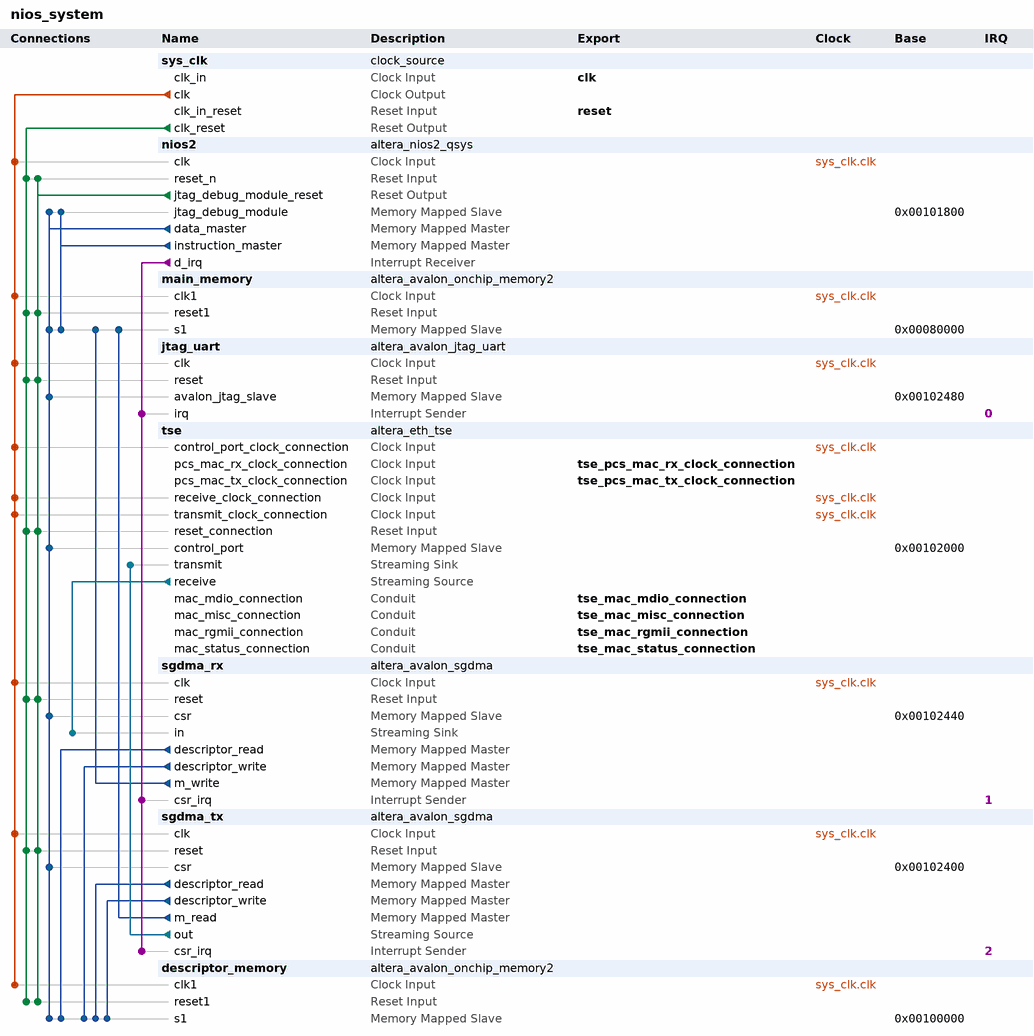
[diagram p0: system contents]
# Platform Designer (Qsys) system nios_system, Cyclone V 5CSEBA6U23I7
# Parameters at their usual value, and those the tool derives, are not listed.
package require -exact qsys 16.1
create_system nios_system
set_project_property DEVICE_FAMILY {Cyclone V}
set_project_property DEVICE 5CSEBA6U23I7

add_instance sys_clk clock_source 16.1
set_instance_parameter_value sys_clk clockFrequency 100000000

add_instance nios2 altera_nios2_qsys 16.1
set_instance_parameter_value nios2 breakSlave nios2.jtag_debug_module
set_instance_parameter_value nios2 exceptionSlave main_memory.s1
set_instance_parameter_value nios2 icache_size 4096
set_instance_parameter_value nios2 impl Small
set_instance_parameter_value nios2 mmu_TLBMissExcSlave None
set_instance_parameter_value nios2 resetSlave main_memory.s1
set_instance_parameter_value nios2 resetrequest_enabled true

add_instance main_memory altera_avalon_onchip_memory2 16.1
set_instance_parameter_value main_memory dataWidth 32
set_instance_parameter_value main_memory dualPort false
set_instance_parameter_value main_memory initMemContent true
set_instance_parameter_value main_memory initializationFileName onchip_mem.hex
set_instance_parameter_value main_memory memorySize 307200

add_instance jtag_uart altera_avalon_jtag_uart 16.1
set_instance_parameter_value jtag_uart simInteractiveOptions NO_INTERACTIVE_WINDOWS

add_instance tse altera_eth_tse 16.1
set_instance_parameter_value tse core_variation MAC_ONLY
set_instance_parameter_value tse enable_hd_logic true
set_instance_parameter_value tse enable_mac_flow_ctrl false
set_instance_parameter_value tse enable_magic_detect true
set_instance_parameter_value tse enable_shift16 true
set_instance_parameter_value tse ifGMII RGMII
set_instance_parameter_value tse ing_addr 11
set_instance_parameter_value tse mdio_clk_div 40
set_instance_parameter_value tse stat_cnt_ena true
set_instance_parameter_value tse transceiver_type NONE

add_instance sgdma_rx altera_avalon_sgdma 16.1
set_instance_parameter_value sgdma_rx enableBurstTransfers false
set_instance_parameter_value sgdma_rx enableUnalignedTransfers false
set_instance_parameter_value sgdma_rx readBlockDataWidth 32
set_instance_parameter_value sgdma_rx sinkErrorWidth 6
set_instance_parameter_value sgdma_rx sourceErrorWidth 0
set_instance_parameter_value sgdma_rx transferMode STREAM_TO_MEMORY
set_instance_parameter_value sgdma_rx writeBurstcountWidth 4

add_instance sgdma_tx altera_avalon_sgdma 16.1
set_instance_parameter_value sgdma_tx enableBurstTransfers false
set_instance_parameter_value sgdma_tx enableUnalignedTransfers false
set_instance_parameter_value sgdma_tx readBlockDataWidth 32
set_instance_parameter_value sgdma_tx sinkErrorWidth 0
set_instance_parameter_value sgdma_tx sourceErrorWidth 1
set_instance_parameter_value sgdma_tx transferMode MEMORY_TO_STREAM
set_instance_parameter_value sgdma_tx writeBurstcountWidth 4

add_instance descriptor_memory altera_avalon_onchip_memory2 16.1
set_instance_parameter_value descriptor_memory dataWidth 32
set_instance_parameter_value descriptor_memory dualPort false
set_instance_parameter_value descriptor_memory initMemContent true
set_instance_parameter_value descriptor_memory initializationFileName onchip_mem.hex
set_instance_parameter_value descriptor_memory memorySize 4096

# connections
add_connection sys_clk.clk descriptor_memory.clk1 clock
add_connection sys_clk.clk jtag_uart.clk clock
add_connection sys_clk.clk main_memory.clk1 clock
add_connection sys_clk.clk nios2.clk clock
add_connection sys_clk.clk sgdma_rx.clk clock
add_connection sys_clk.clk sgdma_tx.clk clock
add_connection sys_clk.clk tse.control_port_clock_connection clock
add_connection sys_clk.clk tse.receive_clock_connection clock
add_connection sys_clk.clk tse.transmit_clock_connection clock
add_connection nios2.jtag_debug_module_reset descriptor_memory.reset1 reset
add_connection nios2.jtag_debug_module_reset jtag_uart.reset reset
add_connection nios2.jtag_debug_module_reset main_memory.reset1 reset
add_connection nios2.jtag_debug_module_reset nios2.reset_n reset
add_connection nios2.jtag_debug_module_reset sgdma_rx.reset reset
add_connection nios2.jtag_debug_module_reset sgdma_tx.reset reset
add_connection nios2.jtag_debug_module_reset tse.reset_connection reset
add_connection sys_clk.clk_reset descriptor_memory.reset1 reset
add_connection sys_clk.clk_reset jtag_uart.reset reset
add_connection sys_clk.clk_reset main_memory.reset1 reset
add_connection sys_clk.clk_reset nios2.reset_n reset
add_connection sys_clk.clk_reset sgdma_rx.reset reset
add_connection sys_clk.clk_reset sgdma_tx.reset reset
add_connection sys_clk.clk_reset tse.reset_connection reset
add_connection nios2.data_master descriptor_memory.s1 avalon
set_connection_parameter_value nios2.data_master/descriptor_memory.s1 baseAddress 0x00100000
add_connection nios2.data_master jtag_uart.avalon_jtag_slave avalon
set_connection_parameter_value nios2.data_master/jtag_uart.avalon_jtag_slave baseAddress 0x00102480
add_connection nios2.data_master main_memory.s1 avalon
set_connection_parameter_value nios2.data_master/main_memory.s1 baseAddress 0x00080000
add_connection nios2.data_master nios2.jtag_debug_module avalon
set_connection_parameter_value nios2.data_master/nios2.jtag_debug_module baseAddress 0x00101800
add_connection nios2.data_master sgdma_rx.csr avalon
set_connection_parameter_value nios2.data_master/sgdma_rx.csr baseAddress 0x00102440
add_connection nios2.data_master sgdma_tx.csr avalon
set_connection_parameter_value nios2.data_master/sgdma_tx.csr baseAddress 0x00102400
add_connection nios2.data_master tse.control_port avalon
set_connection_parameter_value nios2.data_master/tse.control_port baseAddress 0x00102000
add_connection nios2.instruction_master main_memory.s1 avalon
set_connection_parameter_value nios2.instruction_master/main_memory.s1 baseAddress 0x00080000
add_connection nios2.instruction_master nios2.jtag_debug_module avalon
set_connection_parameter_value nios2.instruction_master/nios2.jtag_debug_module baseAddress 0x00101800
add_connection sgdma_rx.descriptor_read descriptor_memory.s1 avalon
set_connection_parameter_value sgdma_rx.descriptor_read/descriptor_memory.s1 baseAddress 0x00100000
add_connection sgdma_rx.descriptor_write descriptor_memory.s1 avalon
set_connection_parameter_value sgdma_rx.descriptor_write/descriptor_memory.s1 baseAddress 0x00100000
add_connection sgdma_rx.m_write main_memory.s1 avalon
set_connection_parameter_value sgdma_rx.m_write/main_memory.s1 baseAddress 0x00080000
add_connection sgdma_tx.descriptor_read descriptor_memory.s1 avalon
set_connection_parameter_value sgdma_tx.descriptor_read/descriptor_memory.s1 baseAddress 0x00100000
add_connection sgdma_tx.descriptor_write descriptor_memory.s1 avalon
set_connection_parameter_value sgdma_tx.descriptor_write/descriptor_memory.s1 baseAddress 0x00100000
add_connection sgdma_tx.m_read main_memory.s1 avalon
set_connection_parameter_value sgdma_tx.m_read/main_memory.s1 baseAddress 0x00080000
add_connection sgdma_tx.out tse.transmit avalon_streaming
add_connection tse.receive sgdma_rx.in avalon_streaming
add_connection nios2.d_irq jtag_uart.irq interrupt
set_connection_parameter_value nios2.d_irq/jtag_uart.irq irqNumber 0
add_connection nios2.d_irq sgdma_rx.csr_irq interrupt
set_connection_parameter_value nios2.d_irq/sgdma_rx.csr_irq irqNumber 1
add_connection nios2.d_irq sgdma_tx.csr_irq interrupt
set_connection_parameter_value nios2.d_irq/sgdma_tx.csr_irq irqNumber 2

# exported interfaces
add_interface clk clock sink
set_interface_property clk EXPORT_OF sys_clk.clk_in
add_interface reset reset sink
set_interface_property reset EXPORT_OF sys_clk.clk_in_reset
add_interface tse_mac_mdio_connection conduit end
set_interface_property tse_mac_mdio_connection EXPORT_OF tse.mac_mdio_connection
add_interface tse_mac_misc_connection conduit end
set_interface_property tse_mac_misc_connection EXPORT_OF tse.mac_misc_connection
add_interface tse_mac_rgmii_connection conduit end
set_interface_property tse_mac_rgmii_connection EXPORT_OF tse.mac_rgmii_connection
add_interface tse_mac_status_connection conduit end
set_interface_property tse_mac_status_connection EXPORT_OF tse.mac_status_connection
add_interface tse_pcs_mac_rx_clock_connection clock sink
set_interface_property tse_pcs_mac_rx_clock_connection EXPORT_OF tse.pcs_mac_rx_clock_connection
add_interface tse_pcs_mac_tx_clock_connection clock sink
set_interface_property tse_pcs_mac_tx_clock_connection EXPORT_OF tse.pcs_mac_tx_clock_connection

set_interconnect_requirement {$system} qsys_mm.clockCrossingAdapter HANDSHAKE
set_interconnect_requirement {$system} qsys_mm.enableEccProtection FALSE
set_interconnect_requirement {$system} qsys_mm.insertDefaultSlave FALSE
set_interconnect_requirement {$system} qsys_mm.maxAdditionalLatency 1

save_system nios_system.qsys
